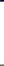
[diagram p0: schematic qcheckedint_abort.asc]
qcheckedint_abort.asc, the LTspice schematic file:
Version 4
SHEET 1 880 680
WIRE 48 80 112 80
WIRE 192 80 240 80
WIRE 80 80 80 300
FLAG 48 160 0
FLAG 240 144 0
FLAG 240 80 out
FLAG 80 300 tap
FLAG 400 96 a
FLAG 400 64 b
FLAG 432 80 c
FLAG 848 64 d
FLAG 800 144 g
FLAG 848 160 s
SYMBOL voltage 48 64 R0
WINDOW 123 0 0 Left 0
SYMATTR InstName V1
SYMATTR Value SINE(0 1 1k) Rser=0.1
BUSTAP 0 0 16 0
SYMBOL res 208 64 R90
WINDOW 0 0 56 VBottom 2
SYMATTR InstName R1
SYMATTR Value 1k
SYMBOL cap 224 80 R0
SYMATTR InstName C1
SYMATTR Value 1µ
SYMBOL mysub 400 64 R0
SYMATTR InstName U1
SYMBOL nosuchpart 600 64 R0
SYMATTR InstName Z9
SYMBOL res 700 64 R0
SYMATTR InstName Rloose
SYMATTR Value 10
SYMBOL nmos 800 2147483647 R0
SYMATTR InstName M1
SYMATTR Value IRF530
TEXT 48 200 Left inf !.tran 5m
TEXT 48 230 Left 2 ;a comment
TEXT 48 260 Left 2 !.param a=1\n.options gmin=1e-12

The netlist it stands for:
* qcheckedint_abort.asc
V1 tap 0 SINE(0 1 1k) Rser=0.1
R1 out tap 1k
C1 out 0 1µ
XU1 a b c MYSUB  ; pins A B C
* Z9: nosuchpart (symbol nosuchpart not available, pin order unknown); nets seen at it: d, g, s
Rloose NC_01 NC_02 10
M1 NC_03 NC_04 NC_05 NC_05 IRF530
.model NMOS NMOS
.model PMOS PMOS
.lib standard.mos
* inf !.tran 5m
* a comment
.param a=1
.options gmin=1e-12
.backanno
.end